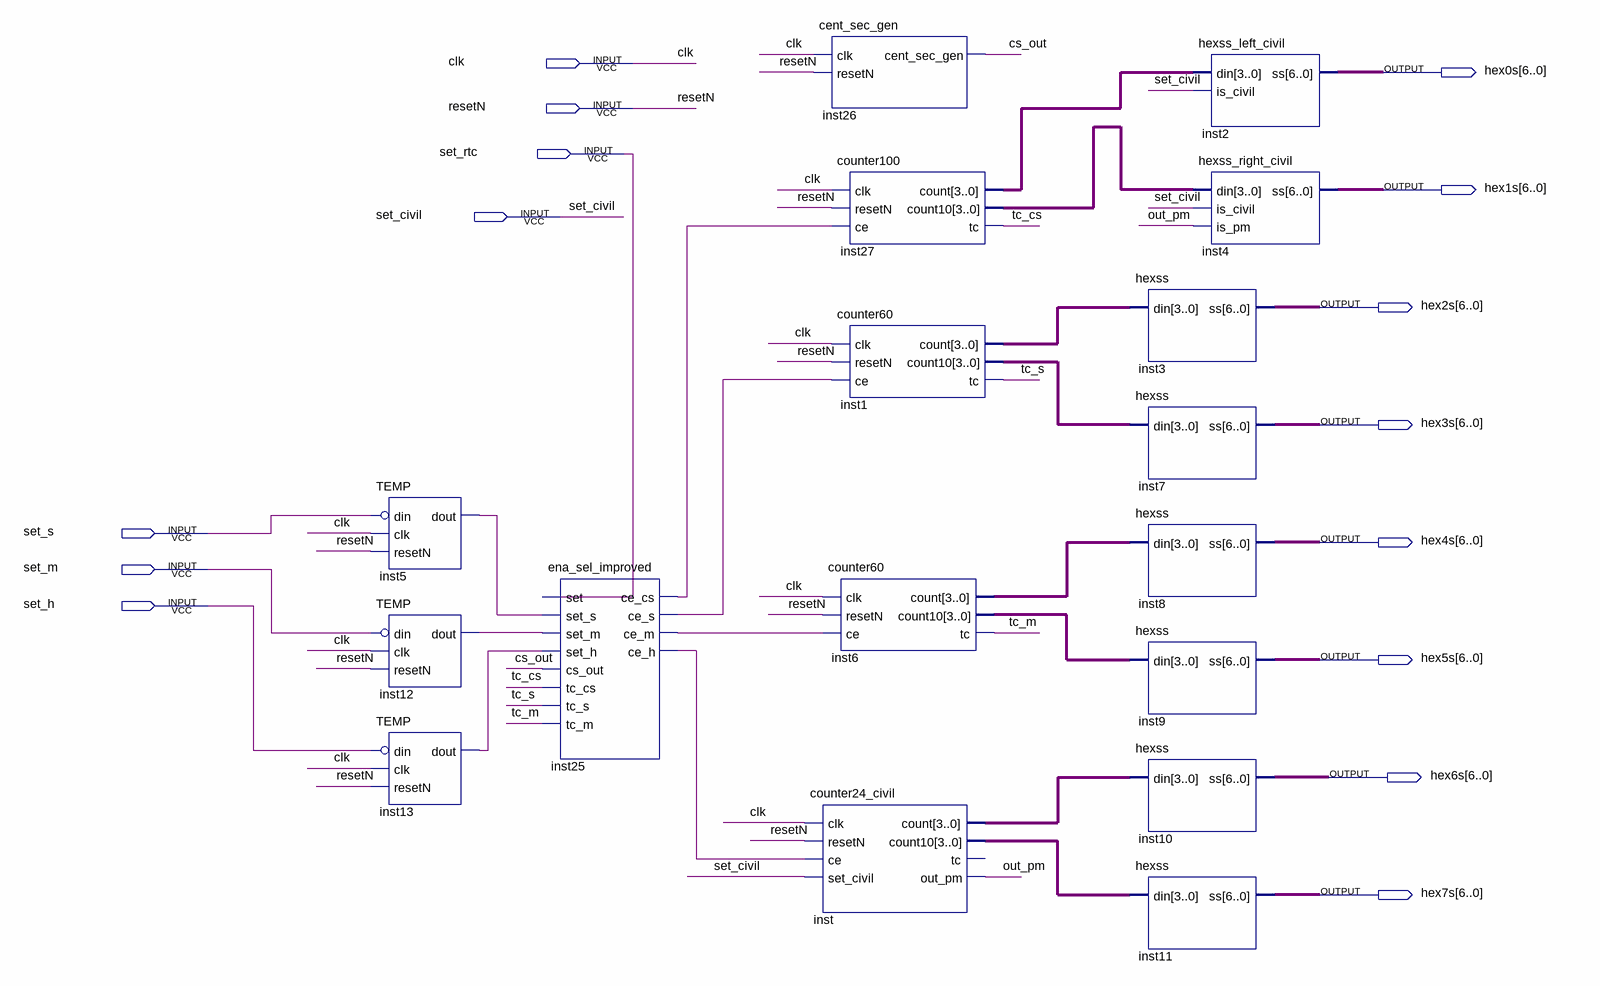
[diagram p0: schematic sheet]
// Quartus schematic rtc_improved_final.bdf as structural Verilog: 17 symbols, 15 pins
module rtc_improved_final (
  input  clk,
  input  resetN,
  input  set_rtc,
  input  set_civil,
  input  set_s,
  input  set_m,
  input  set_h,
  output [6:0] hex0s,
  output [6:0] hex1s,
  output [6:0] hex2s,
  output [6:0] hex3s,
  output [6:0] hex4s,
  output [6:0] hex5s,
  output [6:0] hex6s,
  output [6:0] hex7s
);

  wire cs_out, inst5_dout, inst12_dout, inst13_dout, inst25_ce_cs, inst25_ce_h, inst25_ce_m, inst25_ce_s,
       out_pm, tc_cs, tc_m, tc_s;
  wire [3:0] inst1_count, inst1_count10, inst6_count, inst6_count10, inst27_count, inst27_count10,
       inst_count, inst_count10;

  TEMP inst5 (.din(~set_s), .clk(clk), .resetN(resetN), .dout(inst5_dout));
  TEMP inst12 (.din(~set_m), .clk(clk), .resetN(resetN), .dout(inst12_dout));
  TEMP inst13 (.din(~set_h), .clk(clk), .resetN(resetN), .dout(inst13_dout));
  ena_sel_improved inst25 (
    .set(set_rtc), .set_s(inst5_dout), .set_m(inst12_dout), .set_h(inst13_dout), .cs_out(cs_out),
    .tc_cs(tc_cs), .tc_s(tc_s), .tc_m(tc_m), .ce_cs(inst25_ce_cs), .ce_s(inst25_ce_s), .ce_m(inst25_ce_m),
    .ce_h(inst25_ce_h));
  cent_sec_gen inst26 (.clk(clk), .resetN(resetN), .cent_sec_gen(cs_out));
  counter100 inst27 (
    .clk(clk), .resetN(resetN), .ce(inst25_ce_cs), .count(inst27_count), .count10(inst27_count10), .tc(tc_cs));
  counter60 inst1 (
    .clk(clk), .resetN(resetN), .ce(inst25_ce_s), .count(inst1_count), .count10(inst1_count10), .tc(tc_s));
  counter60 inst6 (
    .clk(clk), .resetN(resetN), .ce(inst25_ce_m), .count(inst6_count), .count10(inst6_count10), .tc(tc_m));
  counter24_civil inst (
    .clk(clk), .resetN(resetN), .ce(inst25_ce_h), .set_civil(set_civil), .count(inst_count),
    .count10(inst_count10), .out_pm(out_pm));  // open: tc
  hexss inst3 (.din(inst1_count), .ss(hex2s));
  hexss inst7 (.din(inst1_count10), .ss(hex3s));
  hexss inst8 (.din(inst6_count), .ss(hex4s));
  hexss inst9 (.din(inst6_count10), .ss(hex5s));
  hexss inst10 (.din(inst_count), .ss(hex6s));
  hexss inst11 (.din(inst_count10), .ss(hex7s));
  hexss_left_civil inst2 (.din(inst27_count), .is_civil(set_civil), .ss(hex0s));
  hexss_right_civil inst4 (.din(inst27_count10), .is_civil(set_civil), .is_pm(out_pm), .ss(hex1s));
endmodule
